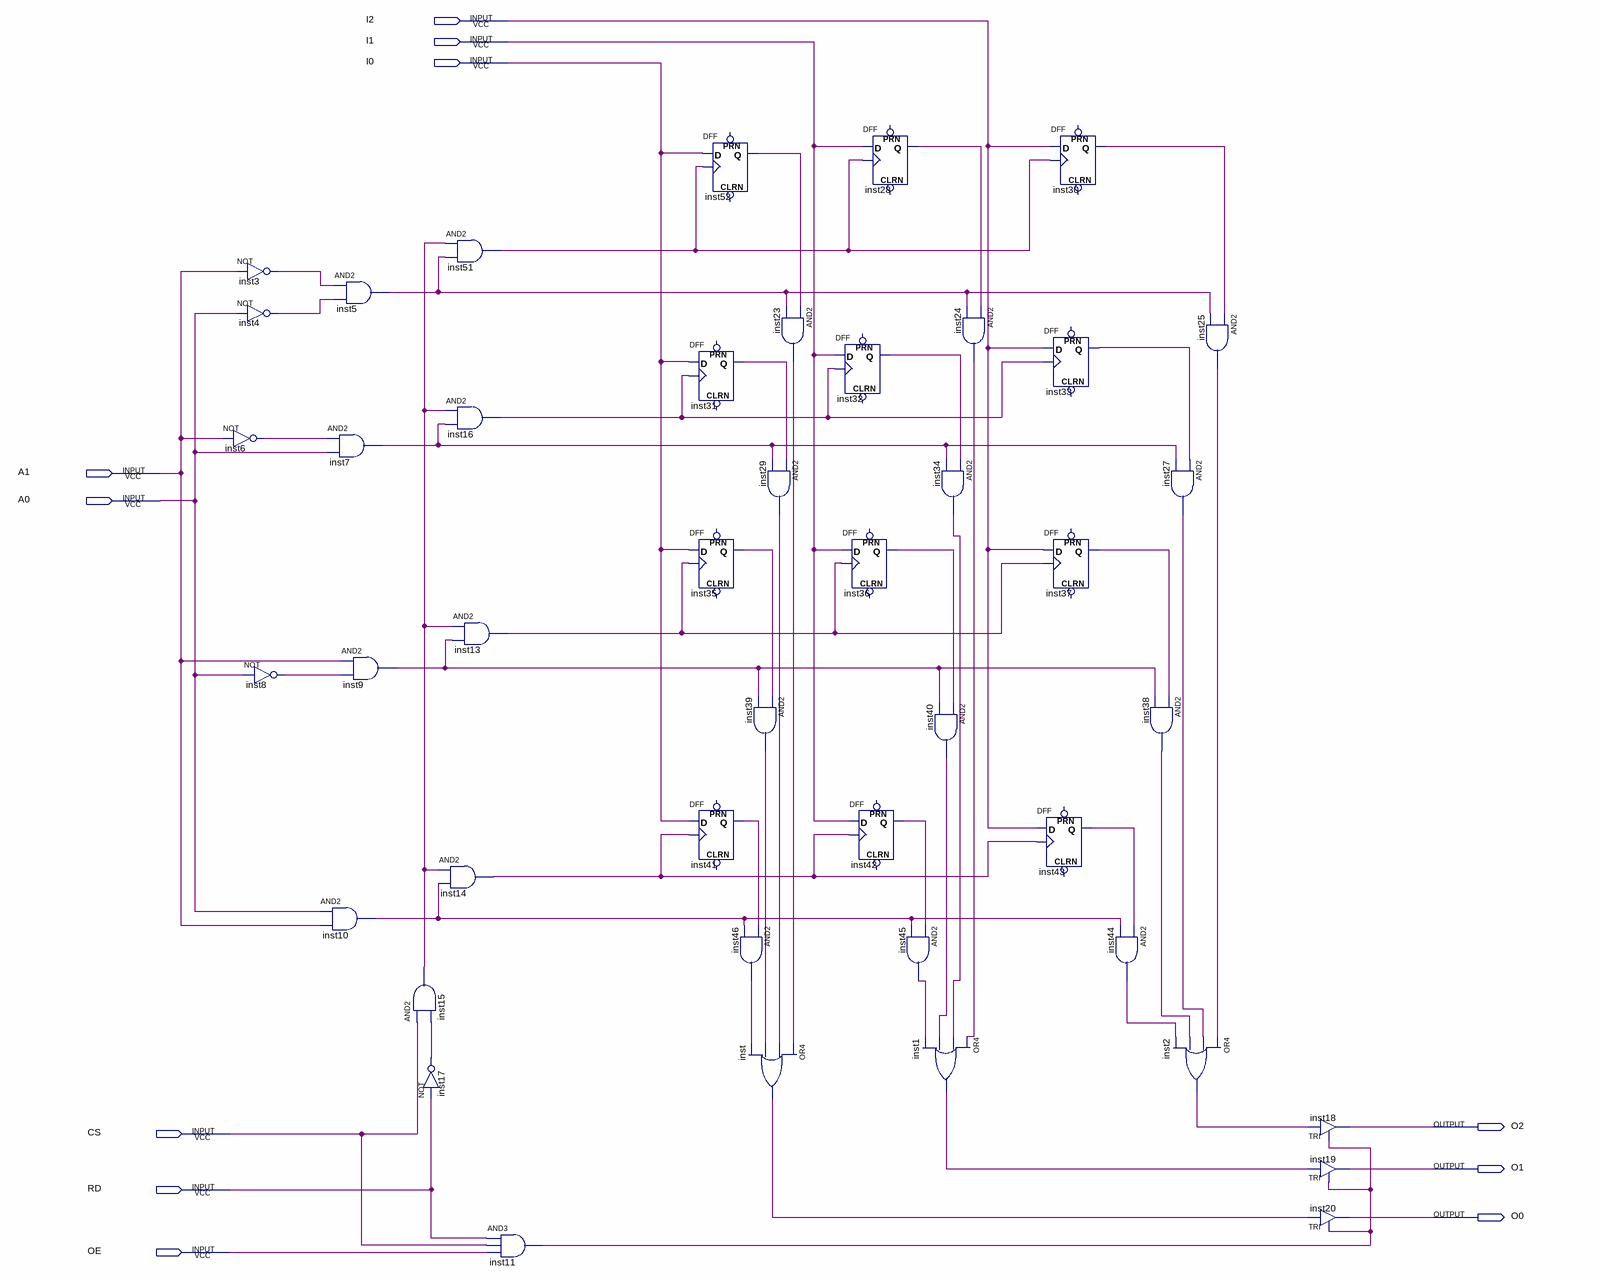
[diagram p0: schematic sheet]
// Quartus schematic MEMORY_4X3.bdf as structural Verilog: 45 symbols, 11 pins
module MEMORY_4X3 (
  input  I2,
  input  I1,
  input  I0,
  input  A1,
  input  A0,
  input  CS,
  input  RD,
  input  OE,
  output O2,
  output O1,
  output O0
);

  wire inst1_out, inst2_out, inst3_out, inst4_out, inst5_out, inst6_out, inst7_out, inst8_out, inst9_out,
       inst10_out, inst11_out, inst13_out, inst14_out, inst15_out, inst16_out, inst17_out, inst23_out,
       inst24_out, inst25_out, inst27_out, inst28_q, inst29_out, inst30_q, inst31_q, inst32_q, inst33_q,
       inst34_out, inst35_q, inst36_q, inst37_q, inst38_out, inst39_out, inst40_out, inst41_q, inst42_q,
       inst43_q, inst44_out, inst45_out, inst46_out, inst51_out, inst52_q, inst_out;

  not inst3 (inst3_out, A1);
  not inst4 (inst4_out, A0);
  not inst6 (inst6_out, A1);
  not inst8 (inst8_out, A0);
  and inst10 (inst10_out, A0, A1);
  and inst5 (inst5_out, inst3_out, inst4_out);
  and inst7 (inst7_out, inst6_out, A0);
  and inst9 (inst9_out, A1, inst8_out);
  and inst15 (inst15_out, CS, inst17_out);
  not inst17 (inst17_out, RD);
  and inst51 (inst51_out, inst15_out, inst5_out);
  and inst16 (inst16_out, inst15_out, inst7_out);
  and inst13 (inst13_out, inst15_out, inst9_out);
  and inst14 (inst14_out, inst15_out, inst10_out);
  and inst11 (inst11_out, RD, CS, OE);
  DFF inst52 (.CLK(inst51_out), .D(I0), .Q(inst52_q));  // open: CLRN, PRN
  DFF inst31 (.CLK(inst16_out), .D(I0), .Q(inst31_q));  // open: CLRN, PRN
  DFF inst35 (.CLK(inst13_out), .D(I0), .Q(inst35_q));  // open: CLRN, PRN
  DFF inst41 (.CLK(inst14_out), .D(I0), .Q(inst41_q));  // open: CLRN, PRN
  and inst29 (inst29_out, inst31_q, inst7_out);
  and inst39 (inst39_out, inst35_q, inst9_out);
  and inst46 (inst46_out, inst41_q, inst10_out);
  or inst (inst_out, inst23_out, inst29_out, inst39_out, inst46_out);
  and inst23 (inst23_out, inst52_q, inst5_out);
  DFF inst28 (.CLK(inst51_out), .D(I1), .Q(inst28_q));  // open: CLRN, PRN
  DFF inst32 (.CLK(inst16_out), .D(I1), .Q(inst32_q));  // open: CLRN, PRN
  DFF inst36 (.CLK(inst13_out), .D(I1), .Q(inst36_q));  // open: CLRN, PRN
  DFF inst42 (.CLK(inst14_out), .D(I1), .Q(inst42_q));  // open: CLRN, PRN
  and inst34 (inst34_out, inst32_q, inst7_out);
  and inst40 (inst40_out, inst36_q, inst9_out);
  and inst45 (inst45_out, inst42_q, inst10_out);
  or inst1 (inst1_out, inst24_out, inst34_out, inst40_out, inst45_out);
  and inst24 (inst24_out, inst28_q, inst5_out);
  DFF inst33 (.CLK(inst16_out), .D(I2), .Q(inst33_q));  // open: CLRN, PRN
  DFF inst37 (.CLK(inst13_out), .D(I2), .Q(inst37_q));  // open: CLRN, PRN
  DFF inst43 (.CLK(inst14_out), .D(I2), .Q(inst43_q));  // open: CLRN, PRN
  DFF inst30 (.CLK(inst51_out), .D(I2), .Q(inst30_q));  // open: CLRN, PRN
  and inst38 (inst38_out, inst37_q, inst9_out);
  and inst44 (inst44_out, inst43_q, inst10_out);
  and inst25 (inst25_out, inst30_q, inst5_out);
  and inst27 (inst27_out, inst33_q, inst7_out);
  or inst2 (inst2_out, inst25_out, inst27_out, inst38_out, inst44_out);
  TRI inst18 (.IN(inst2_out), .OE(inst11_out), .OUT(O2));
  TRI inst19 (.IN(inst1_out), .OE(inst11_out), .OUT(O1));
  TRI inst20 (.IN(inst_out), .OE(inst11_out), .OUT(O0));
endmodule
